# EAGLE design BusinessCard_LA_8CH (EAGLE 9.2.1)
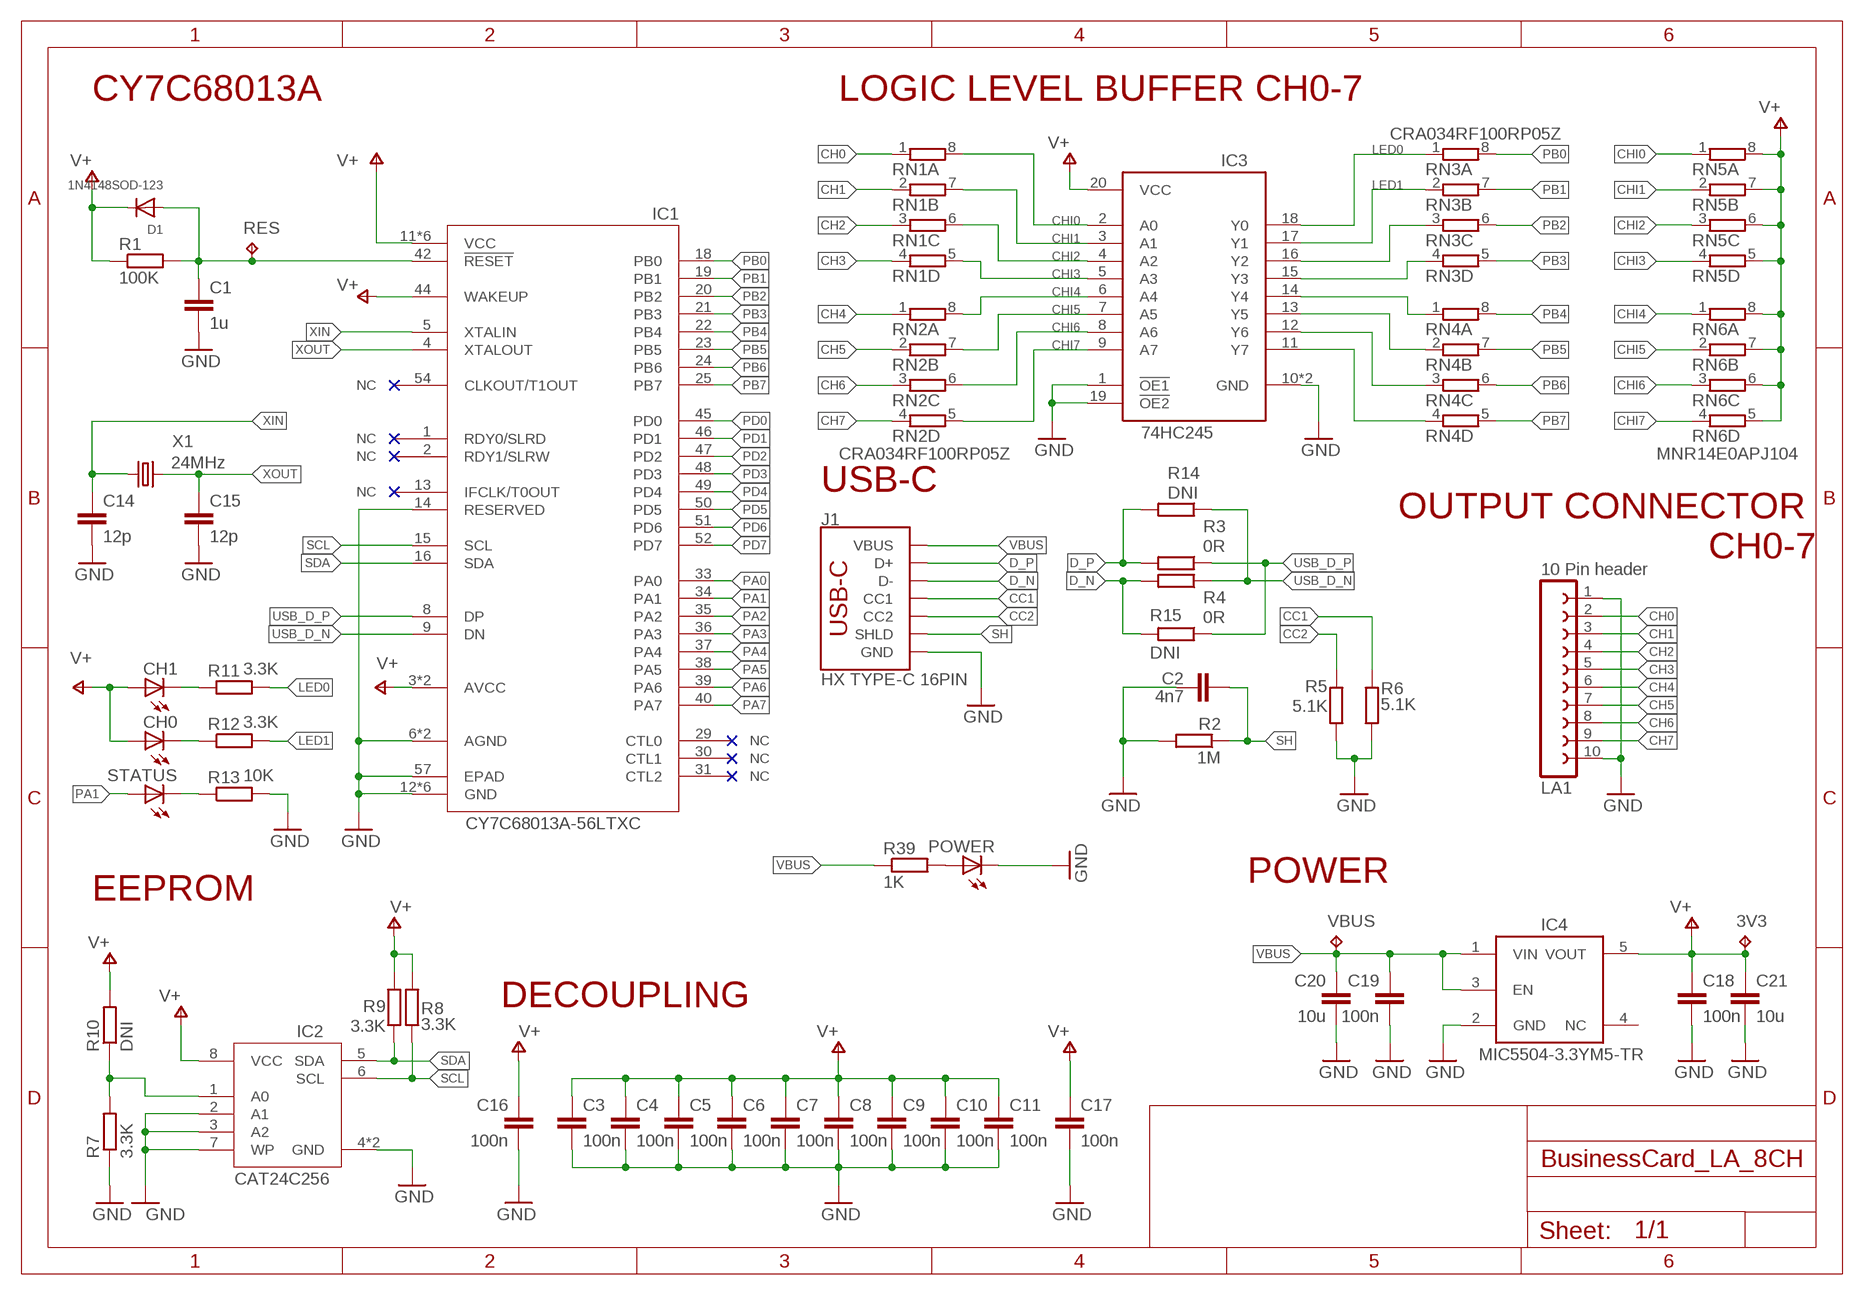
[diagram p0: schematic, sheet 1]

## Parts
3V3  TPB1,27  [B1,27]
C1  1u  C-EUC0402K  [C0402K]
C2  4n7  C-EUC0402K  [C0402K]
C3  100n  C-EUC0402K  [C0402K]
C4  100n  C-EUC0402K  [C0402K]
C5  100n  C-EUC0402K  [C0402K]
C6  100n  C-EUC0402K  [C0402K]
C7  100n  C-EUC0402K  [C0402K]
C8  100n  C-EUC0402K  [C0402K]
C9  100n  C-EUC0402K  [C0402K]
C10  100n  C-EUC0402K  [C0402K]
C11  100n  C-EUC0402K  [C0402K]
C14  12p  C-EUC0402K  [C0402K]
C15  12p  C-EUC0402K  [C0402K]
C16  100n  C-EUC0402K  [C0402K]
C17  100n  C-EUC0402K  [C0402K]
C18  100n  C-EUC0402K  [C0402K]
C19  100n  C-EUC0402K  [C0402K]
C20  10u  C-EUC0805K  [C0805K]
C21  10u  C-EUC0805K  [C0805K]
CH0  19-217/GHC-YR1S2/3T  LEDCHIP-LED0603  [CHIP-LED0603]
CH1  19-217/GHC-YR1S2/3T  LEDCHIP-LED0603  [CHIP-LED0603]
D1  1N4148SOD-123  DIODE_SOD-123FL  [SOD-123FL]
IC1  CY7C68013A-56LTXC  CY7C68013A-56QFNLFXC  [QFN50P800X800X100-57T665]
IC2  CAT24C256HU4IGT3  CAT24C256-HU4  [SON50P300X200X50-9T130X140N]
IC3  SN74LVC541ARGYR  74LVC541A  [QFN50P350X450X100-25T305X205N]
IC4  MIC5504-3.3YM5-TR  [SOT23-5]
J1  HX TYPE-C 16PIN  USB_C_2-LAYER_PADS  [USB-C-16P-2LAYER-PADS]
LA1  10 Pin header  FE10-1  [FE10]
POWER  19-213/Y2C-CQ2R2L/3T(CY)  LEDCHIP-LED0603  [CHIP-LED0603]
R1  100K  R-EU_R0402  [R0402]
R2  1M  R-EU_R0402  [R0402]
R3  0R  R-EU_R0402  [R0402]
R4  0R  R-EU_R0402  [R0402]
R5  5.1K  R-EU_R0402  [R0402]
R6  5.1K  R-EU_R0402  [R0402]
R7  3.3K  R-EU_R0402  [R0402]
R8  3.3K  R-EU_R0402  [R0402]
R9  3.3K  R-EU_R0402  [R0402]
R10  DNI  R-EU_R0402  [R0402]
R11  3.3K  R-EU_R0402  [R0402]
R12  3.3K  R-EU_R0402  [R0402]
R13  10K  R-EU_R0402  [R0402]
R14  DNI  R-EU_R0402  [R0402]
R15  DNI  R-EU_R0402  [R0402]
R39  1K  R-EU_R0402  [R0402]
RES  TPB1,27  [B1,27]
RN1  CRA034RF100RP05Z  4R-NCAT16  [CAT16]
RN2  CRA034RF100RP05Z  4R-NCAT16  [CAT16]
RN3  CRA034RF100RP05Z  4R-NCAT16  [CAT16]
RN4  CRA034RF100RP05Z  4R-NCAT16  [CAT16]
RN5  MNR14E0APJ104  4R-NCAT16  [CAT16]
RN6  MNR14E0APJ104  4R-NCAT16  [CAT16]
STATUS  YLED0603B  LEDCHIP-LED0603  [CHIP-LED0603]
VBUS  TPB1,27  [B1,27]
X1  24MHz  KX-7  [3.2X2.5_KX-7]

## Nets
CC1: J1.A5(CC1) R6.1
CC2: J1.B5(CC2) R5.1
CH0: LA1.2 RN1.1
CH1: LA1.3 RN1.2
CH2: LA1.4 RN1.3
CH3: LA1.5 RN1.4
CH4: LA1.6 RN2.1
CH5: LA1.7 RN2.2
CH6: LA1.8 RN2.3
CH7: LA1.9 RN2.4
CHI0: IC3.2(A0) RN1.8 RN5.1
CHI1: IC3.3(A1) RN1.7 RN5.2
CHI2: IC3.4(A2) RN1.6 RN5.3
CHI3: IC3.5(A3) RN1.5 RN5.4
CHI4: IC3.6(A4) RN2.8 RN6.1
CHI5: IC3.7(A5) RN2.7 RN6.2
CHI6: IC3.8(A6) RN2.6 RN6.3
CHI7: IC3.9(A7) RN2.5 RN6.4
D_N [DIFFPAIR]: J1.A7(D-) J1.B7(D-) R4.2 R15.2
D_P [DIFFPAIR]: J1.A6(D+) J1.B6(D+) R3.2 R14.2
GND: C1.2 C2.2 C3.2 C4.2 C5.2 C6.2 C7.2 C8.2 C9.2 C10.2 C11.2 C14.2 C15.2 C16.2 C17.2 C18.2 C19.2 C20.2 C21.2 IC1.6(AGND) IC1.10(AGND) IC1.12(GND) IC1.14(RESERVED) IC1.26(GND) IC1.28(GND) IC1.41(GND) IC1.53(GND) IC1.56(GND) IC1.57(EPAD) IC2.2(A1) IC2.3(A2) IC2.4(GND) IC2.7(WP) IC2.9(GND) IC3.1(!OE1) IC3.10(GND) IC3.19(!OE2) IC3.PAD(GND) IC4.2(GND) J1.GND J1.GND2(GND) LA1.1 LA1.10 POWER.C R2.2 R5.2 R6.2 R7.1 R13.2
LED0: IC3.18(Y0) R11.2 RN3.1
LED1: IC3.17(Y1) R12.2 RN3.2
N$1: IC2.1(A0) R7.2 R10.1
N$37: POWER.A R39.2
N$193: C1.1 D1.A IC1.42(!RESET) R1.2 RES.TP
N$194: IC3.16(Y2) RN3.3
N$195: IC3.15(Y3) RN3.4
N$198: IC3.14(Y4) RN4.1
N$199: IC3.13(Y5) RN4.2
N$200: IC3.12(Y6) RN4.3
N$201: IC3.11(Y7) RN4.4
N$205: CH1.C R11.1
N$206: CH0.C R12.1
N$207: R13.1 STATUS.C
PA0: IC1.33(PA0)
PA1: IC1.34(PA1) STATUS.A
PA2: IC1.35(PA2)
PA3: IC1.36(PA3)
PA4: IC1.37(PA4)
PA5: IC1.38(PA5)
PA6: IC1.39(PA6)
PA7: IC1.40(PA7)
PB0: IC1.18(PB0) RN3.8
PB1: IC1.19(PB1) RN3.7
PB2: IC1.20(PB2) RN3.6
PB3: IC1.21(PB3) RN3.5
PB4: IC1.22(PB4) RN4.8
PB5: IC1.23(PB5) RN4.7
PB6: IC1.24(PB6) RN4.6
PB7: IC1.25(PB7) RN4.5
PD0: IC1.45(PD0)
PD1: IC1.46(PD1)
PD2: IC1.47(PD2)
PD3: IC1.48(PD3)
PD4: IC1.49(PD4)
PD5: IC1.50(PD5)
PD6: IC1.51(PD6)
PD7: IC1.52(PD7)
SCL: IC1.15(SCL) IC2.6(SCL) R8.1
SDA: IC1.16(SDA) IC2.5(SDA) R9.1
SH: C2.1 J1.SHLD1(SHLD) J1.SHLD2(SHLD) J1.SHLD3(SHLD) J1.SHLD4(SHLD) R2.1
USB_D_N [DIFFPAIR]: IC1.9(DN) R4.1 R14.1
USB_D_P [DIFFPAIR]: IC1.8(DP) R3.1 R15.1
V+: 3V3.TP C3.1 C4.1 C5.1 C6.1 C7.1 C8.1 C9.1 C10.1 C11.1 C16.1 C17.1 C18.1 C21.1 CH0.A CH1.A D1.C IC1.3(AVCC) IC1.7(AVCC) IC1.11(VCC) IC1.17(VCC) IC1.27(VCC) IC1.32(VCC) IC1.43(VCC) IC1.44(WAKEUP) IC1.55(VCC) IC2.8(VCC) IC3.20(VCC) IC4.5(VOUT) R1.1 R8.2 R9.2 R10.2 RN5.5 RN5.6 RN5.7 RN5.8 RN6.5 RN6.6 RN6.7 RN6.8
VBUS: C19.1 C20.1 IC4.1(VIN) IC4.3(EN) J1.VBUS1(VBUS) J1.VBUS2(VBUS) R39.1 VBUS.TP
XIN: C14.1 IC1.5(XTALIN) X1.1
XOUT: C15.1 IC1.4(XTALOUT) X1.3
Unconnected: IC1.1(RDY0/SLRD) IC1.2(RDY1/SLRW) IC1.13(IFCLK/T0OUT) IC1.29(CTL0) IC1.30(CTL1) IC1.31(CTL2) IC1.54(CLKOUT/T1OUT) IC4.4(NC)

## Notes on the sheet
- CY7C68013A | LOGIC LEVEL BUFFER CH0-7
- USB-C
- OUTPUT CONNECTOR 
  CH0-7
- POWER
- EEPROM
- DECOUPLING

## Library data of the parts
3V3 RES VBUS = testpad:TP: Test pad
C1-C11 C14-C21 = rcl:C-EU: CAPACITOR, European symbol; SPICEPREFIX: C
CH0 CH1 POWER STATUS = led:LED: LED OSRAM: - CHIPLED LG R971, LG N971, LY N971, LG Q971, LY Q971, LO R971, LY R971 LH N974, LH R974 LS Q976, LO Q976, LY Q976 LO Q996 - Hyper CHIPLED LW Q18S LB Q993, LB Q99A, LB R99A - SideLED LS A670, LO A670, LY A670, LG A670, LP A670 LB A673, LV A673, LT A673, LW A673 LH A674 LY A675 LS A676, LA A676, LO A676, LY A676, LW A676 LS A679, LY A679, LG A679 - Hyper Micro SIDELED® LS Y876, LA Y876, LO Y876, LY Y876 LT Y87S - SmartLED LW L88C, LW L88S LB L89C, LB L89S, LG L890 LS L89K, LO L89K, LY L89K LS L896, LA L896, LO L896, LY L896 - TOPLED LS T670, LO T670, LY T670, LG T670, LP T670 LSG T670, LSP T670, LSY T670, LOP T670, LYG T670 LG T671, LOG T671, LSG T671 LB T673, LV T673, LT T673, LW T673 LH T674 LS T676, LA T676, LO T676, LY T676, LB T676, LH T676, LSB T676, LW T676 LB T67C, LV T67C, LT T67C, LS T67K, LO T67K, LY T67K, LW E67C LS E67B, LA E67B, LO E67B, LY E67B, LB E67C, LV E67C, LT E67C LW T67C LS T679, LY T679, LG T679 LS T770, LO T770, LY T770, LG T770, LP T770 LB T773, LV T773, LT T773, LW T773 LH T774 LS E675, LA E675, LY E675, LS T675 LS T776, LA T776, LO T776, LY T776, LB T776 LHGB T686 LT T68C, LB T68C - Hyper Mini TOPLED® LB M676 - Mini TOPLED Santana® LG M470 LS M47K, LO M47K, LY M47K Source: http://www.osram.convergy.de LUXEON: - LUMILED® LXK2-PW12-R00, LXK2-PW12-S00, LXK2-PW14-U00, LXK2-PW14-V00 LXK2-PM12-R00, LXK2-PM12-S00, LXK2-PM14-U00 LXK2-PE12-Q00, LXK2-PE12-R00, LXK2-PE12-S00, LXK2-PE14-T00, LXK2-PE14-U00 LXK2-PB12-K00, LXK2-PB12-L00, LXK2-PB12-M00, LXK2-PB14-N00, LXK2-PB14-P00, LXK2-PB14-Q00 LXK2-PR12-L00, LXK2-PR12-M00, LXK2-PR14-Q00, LXK2-PR14-R00 LXK2-PD12-Q00, LXK2-PD12-R00, LXK2-PD12-S00 LXK2-PH12-R00, LXK2-PH12-S00 LXK2-PL12-P00, LXK2-PL12-Q00, LXK2-PL12-R00 Source: www.luxeon.com KINGBRIGHT: KA-3528ASYC Source: www.kingbright.com
D1 = adafruit:DIODE: Diode SMADIODE - SMA Surface Mount Package 20V 1A Schottky Diode Digikey: 641-1014-6-ND DO-1N4148 - Through Hole Small Current Diode SOD-123 20V 1 A (.5mV Vf) Schottky Diode - Digikey: MBRX120TPMSCT-ND SOD-323 10V 570mA (.38mV Vf, 3ns) Schottky Diode - Digikey: ZLLS410CT-ND SOD-523 30V 30mA Schottky Diode (RB751S-40TE61) - Digikey: RB751S-40TE61CT-ND SOT23-R/W - SOT23 Package (R = Solder Paste/Reflow Ovens, W = Hand-Soldering) BAT54Film 40V 300mA - Digikey: 497-7162-1-ND
IC1 = ds_ic_mcu:CY7C68013A-56QFNLFXC: EZ-USB FX2LP USB Microcontroller High-Speed USB Peripheral Controller
IC2 = ds_ic_memory:CAT24C256: The CAT24C256 is a EEPROM Serial 256−Kb I2C, internally organized as 32,768 words of 8 bits each. It features a 64−byte page write buffer and supports the Standard (100 kHz), Fast (400 kHz) and Fast−Plus (1 MHz) I2C protocol. Write operations can be inhibited by taking the WP pin High (this protects the entire memory). External address pins make it possible to address up to eight CAT24C256 devices on the same bus. On−Chip ECC (Error Correction Code) makes the device suitable for high reliability applications.
IC3 = ds_ic_logic:74LVC541: SNx4LVC541A Octal Buffers/Drivers With 3-State Outputs
IC4 = MCU:MIC5504-3.3YM5-TR
J1 = SparkFun-Connectors:USB_C: USB Type C 16Pin Connector Super Speed pins not available on the 16-pin purely SMD connector so this part is best for USB 2.0 implementations. D1 and D2 are tied together enabling D+/- no matter which way the cable is plugged into the connector. The two channel configuration pins (CC1/2) are exposed. These are normally connected to ground via 5.1k resistors but can be reconfigured for high current/high power applications. **4-LAYER BOARD WARNING!!** If designing 4-layer board, make sure to select the variant _4-LAYER-ISOLATED. The linked footprint (USB-C-16-4LAYER-ISOLATED) includes some very necessary cutout polygons in the inner layers (2 and 15). This prevents the PTH mounting shield legs on the USB connector from electrically connecting any other polygons on the inner layers (usually VCC and GND).; PROD_ID: CONN-14122
LA1 = con-lsta:FE10-1: FEMALE HEADER; OC_FARNELL: unknown; OC_NEWARK: unknown
R1-R15 R39 = rcl:R-EU_: RESISTOR, European symbol; SPICEPREFIX: R
RN1-RN6 = resistor-net:4R-N: Array Chip Resistor Source: RS Component / Phycomp; OC_FARNELL: unknown; OC_NEWARK: unknown
X1 = crystal-geyer_V1_0:KX: Quartz Crystals (MHz) SMD: KX - Serie Model Size l/w/h [mm] Frequency Range Frequency Stability Temp. Range [°C] Load Capacitance AECQ 200 availabel Datasheet KX-4 KX-5 KX-6 KX-7 KX-9A KX-9B KX-12A KX-12B KX-13 KX-20 KX-K KX-KS 1.6/1.2/0.3 2.0/1.6/0.45 2.5/2.0/0.55 3.2/2.5/0.8 5.0/3.2/1.0 5.0/3.2/1.1 6.0/3.5/1.1 6.0/3.5/1.0 7.0/5.0 /1.3 11.6/5.5/1.6 12.3/4.5/4.2 12.3/4.5/3.2 24.0 ~ 80.0 MHz 16.0 ~ 80.0 MHz 12.0 ~ 80.0 MHz 8.0 ~ 60.0 MHz 7,68 ~ 300,0 MHz 8,0 ~ 50,0 MHz 8,0 ~ 150,0 MHz 8,0 ~ 50,0 MHz 6,0 ~ 160,0 MHz 3,579 ~ 25,0 MHz 3,579 ~ 70,0 MHz 3,579 ~ 70,0 MHz ±10 … ±50ppm ±10 … ±50ppm ±10 … ±50ppm ±10 … ±50ppm ±10 … ±50ppm ±10 … ±50ppm ±10 … ±50ppm ±10 … ±50ppm ±10 … ±50ppm ±50ppm ±10 … ±50ppm ±10 … ±50ppm (*) -40°C …+85°C (*) -40°C …+125°C (*) -40°C …+125°C (*) -40°C …+125°C (*) -40°C …+105°C (*) -40°C …+105°C (*) -40°C …+125°C (*) -40°C …+105°C (*) -40°C …+105°C (*) -40°C …+105°C (*) -40°C …+85°C (*) -40°C …+85°C 8, 8…16 8, 8…16 10, 8…16 12, 7…20 16, 10…20 16, 10…20 16, 10…20 16, 12…20 16, 12…20 16, 12…20 16, 12…30 16, 12…30 - yes yes yes - - - - - - - - KX-4.pdf <http://www.geyer-electronic.de/uploads/tx_userartikelfrequenz/GEYER-KX-4.pdf> KX-5.pdf <http://www.geyer-electronic.de/uploads/tx_userartikelfrequenz/GEYER-KX-5.pdf> KX-6.pdf <http://www.geyer-electronic.de/uploads/tx_userartikelfrequenz/GEYER-KX-6.pdf> KX-7.pdf <http://www.geyer-electronic.de/uploads/tx_userartikelfrequenz/GEYER-KX-7.pdf> KX-9A.pdf <http://www.geyer-electronic.de/uploads/tx_userartikelfrequenz/GEYER-KX-9A.pdf> KX-9B.pdf <http://www.geyer-electronic.de/uploads/tx_userartikelfrequenz/GEYER-KX-9B.pdf> KX-12A.pdf <http://www.geyer-electronic.de/uploads/tx_userartikelfrequenz/GEYER-KX-12A.pdf> KX-12B.pdf <http://www.geyer-electronic.de/uploads/tx_userartikelfrequenz/GEYER-KX-12B.pdf> KX-13.pdf <http://www.geyer-electronic.de/uploads/tx_userartikelfrequenz/GEYER-KX-13.pdf> KX-20.pdf <http://www.geyer-electronic.de/uploads/tx_userartikelfrequenz/GEYER-KX-20.pdf> KX-K.pdf <http://www.geyer-electronic.de/uploads/tx_userartikelfrequenz/GEYER-KX-K.pdf> KX-KS.pdf <http://www.geyer-electronic.de/uploads/tx_userartikelfrequenz/GEYER-KX-KS.pdf> <http://www.geyer-electronic.de/fileadmin/template/img/logo-geyer-electronic.png> Details see: http://www.geyer-electronic.de/Frequenz-Produkte.9.0.html Created 2016-06-07, Hans Locher 2016 (C) Geyer Quartz Technology KX4,KX5,KX6,KX7,KX9A,KX9B,KX12A,KX12B,KX13,KX20,KXK,KXKS;1612;2016;2520;3225;5032;6035;7050;11655;12345;1,6x1,2;2,0x1,6;2,5x2,0;3,2x2,5;5,0x3,2;6,0x3,5;7,0x5,0;11,6x5,5;12,3x4,5;12,3x4,5;1.6x1.2;2.0x1.6;2.5x2.0;3.2x2.5;5.0x3.2;6.0x3.5;7.0x5.0;11.6x5.5;12.3x4.5;12.3x4.5;

## Net classes
1 DIFFPAIR: width 0.2 mm, drill 0.2 mm, clearance 0.1 mm

## Board
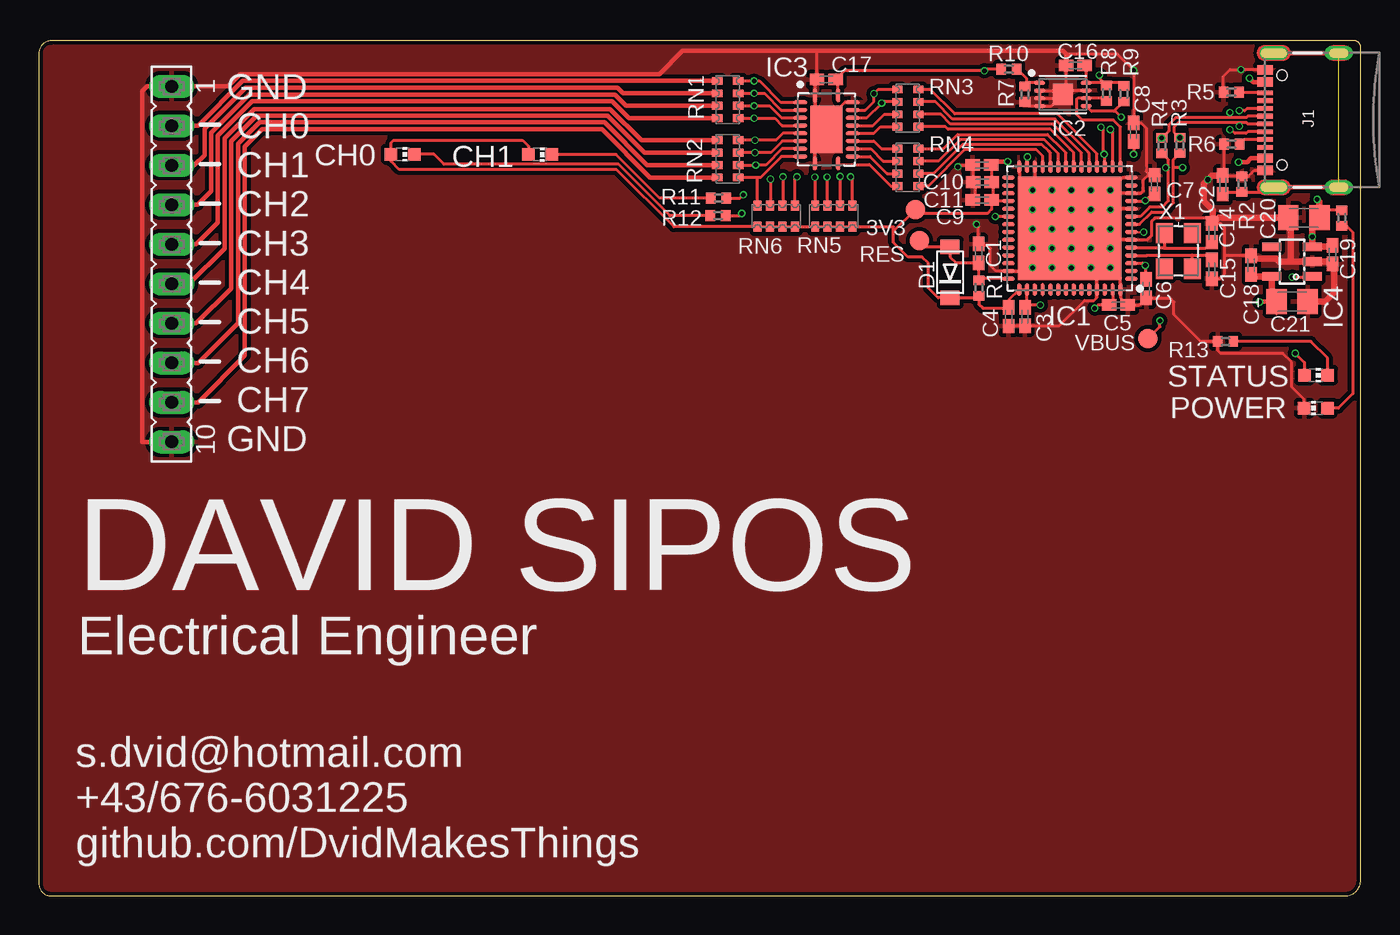
[diagram p1: board, top side]
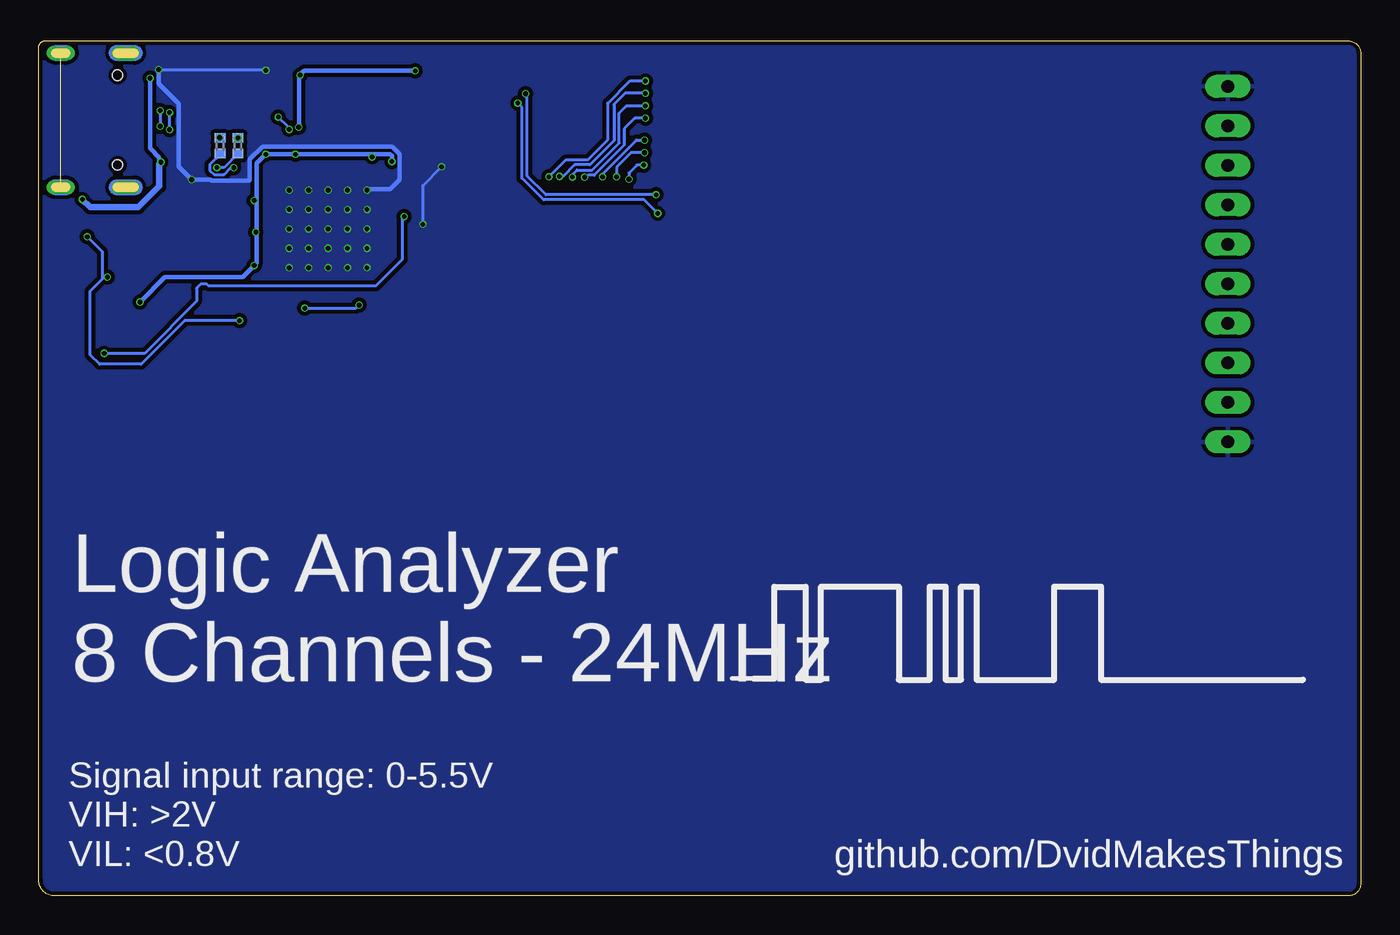
[diagram p2: board, bottom side, seen from below]

Size 85 x 55 mm. Coordinates in mm from the lower left corner, seen from the top.
Outline: 0,54.22 0,0.78 arc90 0.78,0 84,0 arc90 85,1 85,54.6 arc90 84.6,55 0.78,55 arc90 0,54.22
Copper layers (1*16): Top 0.035mm / dielectric 1.6mm / Bottom 0.035mm
Design rules "jlcpcb-2layers": minimum track width 5mil, minimum drill 0.3mm, track to track 5mil, track to pad 5mil, pad to pad 5mil, via to via 5mil, smd to smd 5mil, copper to edge 0.2mm, drill to drill 6mil, minimum pad ring 10mil, minimum via ring 3mil, stop-mask expansion 4mil, vias tented up to drill 0mil, thermal gap 10mil

### Footprints (pad centres in the part's own frame; a part is rotated, then mirrored left to right if it is on the bottom)
B1,27 = smd 1.27 x 1.27: TP 0,0
C0402K = smd 0.925 x 0.74: 1 -0.6,0; 2 0.6,0
C0805K = smd 1.3 x 1.6: 1 -1,0; 2 1,0
CHIP-LED0603 = smd 0.8 x 0.8: A 0,-0.75; C 0,0.75
SOD-123FL = smd 0.91 x 1.22: A 1.637,0; C -1.637,0
QFN50P800X800X100-57T665 = smd 0.811 x 0.264: 1 -3.951,3.25; 2 -3.951,2.75; 3 -3.951,2.25; 4 -3.951,1.75; 5 -3.951,1.25; 6 -3.951,0.75; 7 -3.951,0.25; 8 -3.951,-0.25; 9 -3.951,-0.75; 10 -3.951,-1.25; 11 -3.951,-1.75; 12 -3.951,-2.25; 13 -3.951,-2.75; 14 -3.951,-3.25; 29 3.951,-3.25; 30 3.951,-2.75; 31 3.951,-2.25; 32 3.951,-1.75; 33 3.951,-1.25; 34 3.951,-0.75; 35 3.951,-0.25; 36 3.951,0.25; 37 3.951,0.75; 38 3.951,1.25; 39 3.951,1.75; 40 3.951,2.25; 41 3.951,2.75; 42 3.951,3.25 | smd 0.264 x 0.811: 15 -3.25,-3.951; 16 -2.75,-3.951; 17 -2.25,-3.951; 18 -1.75,-3.951; 19 -1.25,-3.951; 20 -0.75,-3.951; 21 -0.25,-3.951; 22 0.25,-3.951; 23 0.75,-3.951; 24 1.25,-3.951; 25 1.75,-3.951; 26 2.25,-3.951; 27 2.75,-3.951; 28 3.25,-3.951; 43 3.25,3.951; 44 2.75,3.951; 45 2.25,3.951; 46 1.75,3.951; 47 1.25,3.951; 48 0.75,3.951; 49 0.25,3.951; 50 -0.25,3.951; 51 -0.75,3.951; 52 -1.25,3.951; 53 -1.75,3.951; 54 -2.25,3.951; 55 -2.75,3.951; 56 -3.25,3.951 | smd 6.65 x 6.65: 57 0,0
SON50P300X200X50-9T130X140N = smd 0.711 x 0.27: 1 -1.501,0.75; 2 -1.501,0.25; 3 -1.501,-0.25; 4 -1.501,-0.75; 5 1.501,-0.75; 6 1.501,-0.25; 7 1.501,0.25; 8 1.501,0.75 | smd 1.3 x 1.4: 9 0,0
QFN50P350X450X100-25T305X205N = smd 0.264 x 0.896: 1 -0.75,2.187; 10 -0.75,-2.187; 11 0.75,-2.187; 20 0.75,2.187 | smd 0.896 x 0.264: 2 -1.687,1.75; 3 -1.687,1.25; 4 -1.687,0.75; 5 -1.687,0.25; 6 -1.687,-0.25; 7 -1.687,-0.75; 8 -1.687,-1.25; 9 -1.687,-1.75; 12 1.687,-1.75; 13 1.687,-1.25; 14 1.687,-0.75; 15 1.687,-0.25; 16 1.687,0.25; 17 1.687,0.75; 18 1.687,1.25; 19 1.687,1.75 | smd 2.05 x 3.05: PAD 0,0
SOT23-5 = smd 0.55 x 1.2: 1 -0.95,-1.3; 2 0,-1.3; 3 0.95,-1.3; 4 0.95,1.3; 5 -0.95,1.3
USB-C-16P-2LAYER-PADS = smd 0.3 x 1: A5 -1.25,-0.34; A6 -0.25,-0.34; A7 0.25,-0.34; A8 1.25,-0.34; B5 1.75,-0.34; B6 0.75,-0.34; B7 -0.75,-0.34; B8 -1.75,-0.34 | smd 0.6 x 1: GND -3.225,-0.34; GND2 3.225,-0.34; VBUS1 -2.45,-0.34; VBUS2 2.45,-0.34 | drill 0.4 pad 0.6 long: SHLD1 -4.318,-0.915; SHLD2 4.318,-0.915; SHLD3 -4.318,-5.095; SHLD4 4.318,-5.095 | hole 0.65: -2.89,-1.445; 2.89,-1.445
FE10 = drill 0.813 long: 1 -11.43,0; 2 -8.89,0; 3 -6.35,0; 4 -3.81,0; 5 -1.27,0; 6 1.27,0; 7 3.81,0; 8 6.35,0; 9 8.89,0; 10 11.43,0
R0402 = smd 0.6 x 0.7: 1 -0.5,0; 2 0.5,0
CAT16 = smd 0.5 x 0.65: 1 -1.2,-0.675; 2 -0.4,-0.675; 3 0.4,-0.675; 4 1.2,-0.675; 5 1.2,0.675; 6 0.4,0.675; 7 -0.4,0.675; 8 -1.2,0.675
3.2X2.5_KX-7 = smd 1.3 x 1.1: 1 -1.15,-0.9; 2 1.15,-0.9; 3 1.15,0.9; 4 -1.15,0.9

### Placement (x,y rotation side)
3V3  56.36,44.14 0 top
C1  60.43,41.33 90 top
C2  76.13,45.74 90 top
C3  63.41,37.27 270 top
C4  62.36,37.25 270 top
C5  69.42,38.01 0 top
C6  71.21,39.06 270 top
C7  71.74,45.76 90 top
C8  70.39,49.13 90 top
C9  60.66,44.76 180 top
C10  60.64,47.01 180 top
C11  60.67,45.91 180 top
C14  75.43,42.65 90 top
C15  75.43,40.3 270 top
C16  66.66,53.41 180 top
C17  50.64,52.51 180 top
C18  77.96,40.58 90 top
C19  83.19,41.25 270 top
C20  81.35,43.62 180 top
C21  80.59,38.23 0 top
CH0  23.39,47.7 270 top
CH1  32.23,47.68 270 top
D1  58.6,40.11 90 top
IC1  66.3,42.95 180 top
IC2  65.85,51.55 0 top
IC3  50.65,49.3 0 top
IC4  80.59,40.8 90 top
J1  78.5,49.9 90 top
LA1  8.54,40.64 270 top
POWER  82.12,31.38 90 top
R1  60.45,39.1 90 top
R2  77.37,45.78 90 top
R3  73.37,48.27 90 top
R4  72.22,48.26 90 top
R5  76.68,51.7 180 top
R6  76.71,48.35 180 top
R7  63.4,51.56 90 top
R8  68.65,51.63 90 top
R9  69.77,51.59 90 top
R10  62.38,53.17 180 top
R11  43.71,44.89 0 top
R12  43.68,43.75 0 top
R13  76.31,35.67 180 top
R14  73.35,48.25 90 bottom
R15  72.2,48.25 90 bottom
R39  83.78,43.6 270 top
RES  56.64,42.14 0 top
RN1  44.3,51.22 270 top
RN2  44.3,47.41 270 top
RN3  55.88,50.67 270 top
RN4  55.88,46.86 270 top
RN5  51.12,43.72 180 top
RN6  47.42,43.72 180 top
STATUS  82.13,33.49 270 top
VBUS  71.32,35.84 0 top
X1  73.27,41.49 270 top

### Tracks (layer width: path | path; a pad name or v marks a point on that pad's centre or on a via)
CC1
  Top 0.203: J1.A5 77.51,48.65 R6.1
CC2
  Top 0.203: J1.B5 77.23,51.65 R5.1
CH0
  Top 0.305: RN1.1 13.12,52.42 10.23,49.53 LA1.2
CH1
  Top 0.305: RN1.2 37.57,51.62 37.2,51.99 13.3,51.99 10.65,49.34 10.65,47.65 9.99,46.99 LA1.3
CH2
  Top 0.305: RN1.3 37.76,50.82 37.04,51.54 13.61,51.54 13.59,51.56 13.55,51.56 11.08,49.09 11.08,45.33 10.2,44.45 LA1.4
CH3
  Top 0.305: RN1.4 37.95,50.02 36.86,51.11 13.71,51.11 11.51,48.91 11.51,43.31 10.11,41.91 LA1.5
CH4
  Top 0.305: RN2.1 38.75,48.61 36.74,50.62 13.83,50.62 11.95,48.73 11.95,41.65 9.67,39.37 LA1.6
CH5
  Top 0.305: RN2.2 38.94,47.81 36.56,50.19 14.01,50.19 12.38,48.55 12.38,39.08 10.13,36.83 LA1.7
CH6
  Top 0.305: RN2.3 39.12,47.01 36.38,49.75 14.19,49.75 12.81,48.37 12.81,36.86 10.24,34.29 LA1.8
CH7
  Top 0.305: RN2.4 39.31,46.21 36.2,49.32 14.37,49.32 13.24,48.19 13.24,34.74 10.25,31.75 LA1.9
CHI0  (via drill 0.3)
  Top 0.203: RN5.1 52.32,46.13 v52.2,46.25 | RN1.8 v46,52.42 46.33,52.42 47.7,51.05 IC3.2
  Bottom 0.203: v52.2,46.25 51.1,47.35 49.7,47.35 48.4,48.65 48.4,51 46.98,52.42 v46,52.42
CHI1  (via drill 0.3)
  Top 0.203: RN1.7 v46,51.62 46.66,51.62 47.73,50.55 IC3.3 | v51.53,46.28 51.53,44.4 RN5.2
  Bottom 0.203: v46,51.62 47.31,51.62 48.02,50.92 48.02,48.57 49.56,47.02 50.55,47.02 51.29,46.28 v51.53,46.28
CHI2  (via drill 0.3)
  Top 0.203: RN1.6 v46,50.82 47,50.82 47.77,50.05 IC3.4 | RN5.3 50.72,46.21 v50.69,46.24
  Bottom 0.203: v50.69,46.24 50.69,46.4 50.4,46.69 49.43,46.69 47.69,48.43 47.69,50.35 47.22,50.82 v46,50.82
CHI3  (via drill 0.3)
  Top 0.203: RN1.5 v46,50.02 47.33,50.02 47.8,49.55 IC3.5 | v49.9,46.23 49.92,46.22 RN5.4
  Bottom 0.203: v46,50.02 46.68,50.02 47.36,49.34 47.36,48.29 49.29,46.36 49.7,46.36 49.83,46.23 v49.9,46.23
CHI4  (via drill 0.3)
  Top 0.203: IC3.6 47.85,49.05 47.41,48.61 v46.05,48.61 RN2.8 | RN6.1 48.62,46.12 v48.75,46.25
  Bottom 0.203: v48.75,46.25 48.75,46.43 46.57,48.61 v46.05,48.61
CHI5  (via drill 0.3)
  Top 0.203: IC3.7 47.82,48.55 47.08,47.81 v46.05,47.81 RN2.7 | v47.85,46.25 47.85,44.42 RN6.2
  Bottom 0.203: v46.05,47.81 46.91,47.81 47.85,46.87 v47.85,46.25
CHI6  (via drill 0.3)
  Top 0.203: IC3.8 47.78,48.05 46.74,47.01 v46.1,47.01 RN2.6 | v47.05,46.1 47.05,44.42 RN6.3
  Bottom 0.203: v46.1,47.01 46.54,47.01 47.05,46.5 v47.05,46.1
CHI7
  Top 0.203: IC3.9 47.75,47.55 46.41,46.21 46.15,46.21 | 46.15,46.21 RN2.5 | RN6.4 46.22,46.14 46.15,46.21
D_N  (via drill 0.3)
  Top 0.2: J1.A7 77.74,50.15 77.65,50.06 76.6,50.06 | 76.6,50.06 73.11,50.06 72.65,49.6 72.65,49.19 R4.2 R15.2 | v76.6,49.28 76.69,49.28 76.91,49.06 77.65,49.06 77.74,49.15 J1.B7 | v76.6,50.39 76.6,50.06
  Bottom 0.2: v76.6,49.28 v76.6,50.39
  other vias: 72.2,48.75
D_P  (via drill 0.3)
  Top 0.2: J1.A6 77.74,49.65 77.65,49.74 77.2,49.74 | 77.2,49.74 73.29,49.74 73,49.45 73,49.14 R3.2 | J1.B6 77.69,50.65 77.54,50.5 77.22,50.5 v77.2,50.52 | v77.2,49.51 77.2,49.74
  Bottom 0.2: R3.2 R14.2 | v77.2,50.52 v77.2,49.51
  other vias: 73.37,48.77
GND  (via drill 0.3)
  Top 0.127: 69.2,44.2 68.95,44.2 v68.9,44.15
  Top 0.2: IC2.3 IC2.2 65.6,51.8 IC2.9 | IC2.3 IC2.4 | IC2.4 63.66,50.8 R7.1 | IC2.3 65.6,51.3 IC2.9 | IC2.4 65.1,50.8 IC2.9 | IC2.7 66.1,51.8 IC2.9 | C16.2 66.06,51.76 IC2.9 | 66.19,54.14 66.12,54.08 66.08,54.02 | C6.2 71.17,38.42 70.76,38.01 C5.2 69.55,38.48 IC1.56 69.55,39.75 v68.9,40.4 68.85,40.4 IC1.57 | C4.2 62.38,36.67 C3.2 65.62,36.67 67.25,38.3 67.85,38.3 68.05,38.5 IC1.53 68.05,40 v67.65,40.4 v66.4,41.65 66.3,41.75 IC1.57 | C7.2 71.34,46.36 71.04,46.06 71.04,45.36 70.88,45.2 IC1.12 69.1,45.2 v68.9,45.4 | v70.4,53.1 C8.2 | C10.2 60.07,46.98 C11.2 | 60.19,45.95 60.19,44.89 C9.2 | C1.2 60.51,41.85 61,41.85 61.2,41.65 61.2,40.55 61.55,40.2 IC1.41 63.7,40.2 63.83,40.33 | 78,46.51 78.17,46.67 J1.GND | v77.3,53.15 78.81,53.15 J1.GND2 | IC1.10 69.2,44.2 | 63.83,40.33 v63.9,40.4 | 71.33,42.23 71.3,42.2 IC1.6 69.45,42.2 69.42,42.17 67.08,42.17 IC1.57 | IC1.26 64.05,45.55 | 64.05,45.55 v63.9,45.4 63.05,46.25 IC1.28 | 66.3,44.05 66.3,44.25 | 66.3,44.25 v65.15,45.4 v65.15,44.15 65.15,44.1 IC1.57 | 66.3,44.25 66.3,45.3 v66.4,45.4 | 66.3,44.05 v67.65,45.4 | v68.9,45.4 68.75,45.4 IC1.57 | IC1.57 65.1,44.15 v63.9,44.15 | IC1.57 66.3,44.05 | v68.9,44.15 68.8,44.15 67.6,42.95 | IC1.57 67.6,42.95 | 67.6,42.95 v67.65,42.9 | IC1.57 63.95,42.95 v63.9,42.9 | IC1.57 65.2,42.95 v65.15,42.9 v63.9,41.65 | IC1.57 63.83,40.48 63.83,40.33 | v65.15,40.4 v65.15,41.65 65.15,41.8 IC1.57 | IC1.57 66.3,40.5 v66.4,40.4 | IC1.57 64.05,45.2 64.05,45.55 | IC1.57 66.35,42.9 v68.9,42.9 | IC1.57 67.6,41.65 v68.9,41.65 | IC1.57 66.45,42.95 v67.65,44.15 | IC1.14 69.7,46.2 v68.9,45.4
  Top 0.203: 71.33,42.23 71.55,42.45 71.55,43.4 71.75,43.6 75.08,43.6 C14.2 75.5,43.25 76,43.25 76.25,43 76.25,41.2 | C15.2 75.95,39.7 76.25,40 76.25,41.2 | IC3.PAD 49.9,50.05 IC3.1 49.9,52.37 C17.2 50.04,54.29 50.1,54.35 | IC3.19 51.85,51.05 50.65,49.85 IC3.PAD | IC3.10 49.9,48.55 IC3.PAD | 78,46.51 77.78,46.28 R2.2 77.31,46.34 C2.2 76.21,46.42 R6.2 | 71.17,38.42 72.78,38.42 73,38.2 73,37.4 74.73,35.67 R13.2 75.81,35.09 76,34.9 80,34.9 80.57,34.33 80.57,32.74 81.37,31.94 POWER.C | C8.2 70.87,49.73 71.21,49.39 71.21,46.59 71.44,46.36 C7.2 | C1.2 60.43,43.07 v60.3,43.2 | v59.1,46.9 59.21,47.01 C10.2 | C18.2 77.94,41.2 76.25,41.2 | R5.2 76.18,52.73 76.6,53.15 v77.3,53.15 | v70.4,53.1 69.36,54.14 66.19,54.14
  Top 0.305: 66.12,54.08 65.85,54.35 50.1,54.35 41.4,54.35 39.9,52.85 12.94,52.85 12.16,52.07 LA1.1 6.97,52.07 6.65,51.75 6.65,29.2 6.66,29.21 LA1.10 | 66.08,54.02 66.08,53.42 C16.2 | C11.2 60.15,45.91 60.19,45.95
  Top 0.406: C21.2 82.73,38.23 83.3,38.8 83.3,40.54 C19.2 83.04,40.8 IC4.2 80.5,40.8 | C18.2 78.14,41 79.55,41 79.75,40.8 80.5,40.8 | 80.5,40.8 80.5,43.47 C20.2 75.87,43.62 75.5,43.25 75.5,44.1 74.9,44.7 74.9,45.8 v75.17,46.08 75.44,46.34 C2.2
  Bottom 0.203: v60.3,43.2 60.3,45.7 v59.1,46.9 | v77.3,53.15 70.45,53.15 v70.4,53.1
  Bottom 0.305: v77.3,53.15 77.3,52.25 76,50.95 76,46.9 v75.17,46.08 73.95,46.08 73.89,46.02 71.49,46.02 71.43,46.08 71.43,47.38 70.61,48.21 62.3,48.21 61.79,47.7 61.79,46.06 62.4,45.45 63.85,45.45 v63.9,45.4
  other vias: 66.4,42.9 67.65,41.65 66.4,44.15
  pour Top (isolate 0.254): -2.76,56.5 87.55,56.5 87.55,-1.9 -2.76,-1.9
  pour Bottom (isolate 0.254): -3.98,56.5 88,56.5 88,-1.9 -3.98,-1.9
LED0  (via drill 0.3)
  Top 0.2: R11.2 45.09,44.89 v45.3,45.1 | RN3.1 53.97,51.87 v53.7,51.6 53.7,51.1 53.15,50.55 IC3.18
  Bottom 0.2: v45.3,45.1 52.4,45.1 53.6,46.3 53.6,51.6 v53.7,51.6
LED1  (via drill 0.3)
  Top 0.2: R12.2 45.05,43.76 v45.2,43.9 | IC3.17 53.25,50.05 v54.2,51 54.27,51.07 RN3.2
  Bottom 0.2: v45.2,43.9 46.07,44.77 52.53,44.77 53.93,46.16 53.93,50.73 v54.2,51
N$1
  Top 0.2: IC2.1 63.64,52.3 R7.2
  Top 0.203: R10.1 62.93,53.17 63.5,52.6 63.5,52.16 R7.2
N$37
  Top 0.203: R39.2 84.08,43.1 84.5,42.68 84.5,32.31 83.56,31.38 POWER.A
N$193
  Top 0.2: D1.A 58.6,41.1 58.97,40.73 C1.1 60.43,39.8 | 60.43,39.8 60.43,39.62 R1.2 | IC1.42 60.53,39.7 60.43,39.8
  Top 0.203: RES.TP 57.03,41.75 D1.A
N$194
  Top 0.203: IC3.16 53.65,49.55 54.37,50.27 RN3.3
N$195
  Top 0.203: IC3.15 53.7,49.05 54.12,49.47 RN3.4
N$198
  Top 0.203: IC3.14 53.7,48.55 54.19,48.06 RN4.1
N$199
  Top 0.203: IC3.13 53.5,48.05 54.29,47.26 RN4.2
N$200
  Top 0.203: IC3.12 53.45,47.55 54.54,46.46 RN4.3
N$201
  Top 0.203: IC3.11 51.46,47.05 53.4,47.05 54.79,45.66 RN4.4
N$205
  Top 0.2: R11.1 39.91,44.89 37.12,47.68 CH1.C
N$206
  Top 0.2: R12.1 40.58,43.76 37.28,47.05 26.05,47.05 25.4,47.7 CH0.C
N$207
  Top 0.2: STATUS.C 82.88,34.59 81.81,35.67 R13.1
PA1  (via drill 0.3)
  Top 0.2: IC1.34 61.56,43.7 61.53,43.73
  Top 0.203: 61.53,43.73 v61.51,43.7 | v80.8,34.9 81.38,34.32 STATUS.A
  Bottom 0.203: v61.51,43.7 61.63,43.58 61.63,40.94 63.34,39.23 74.09,39.23 74.21,39.35 74.59,39.35 74.86,39.09 74.86,38.24 78.2,34.9 v80.8,34.9
PB0
  Top 0.2: IC1.18 68.05,47.73 67.89,47.89
  Top 0.203: 67.89,47.89 65.48,50.3 58.9,50.3 57.33,51.87 RN3.8
PB1
  Top 0.2: IC1.19 67.55,47.77 67.48,47.83
  Top 0.203: 67.48,47.83 65.35,49.97 58.76,49.97 57.66,51.07 RN3.7
PB2
  Top 0.2: IC1.20 67.05,47.8 67,47.85
  Top 0.203: RN3.6 58,50.27 58.63,49.64 65.21,49.64 67,47.85
PB3
  Top 0.2: IC1.21 66.55,47.81 66.33,48.03
  Top 0.203: 66.33,48.03 65.05,49.31 58.47,49.31 58.3,49.47 RN3.5
PB4
  Top 0.2: IC1.22 66.05,47.8 65.88,47.98
  Top 0.203: 65.88,47.98 64.87,48.98 59.08,48.98 58.16,48.06 RN4.8
PB5
  Top 0.2: IC1.23 65.55,47.75 65.3,48
  Top 0.203: 65.3,48 64.65,48.65 59.25,48.65 57.86,47.26 RN4.7
PB6
  Top 0.2: IC1.24 65.05,47.78 64.94,47.89
  Top 0.203: 64.94,47.89 64.51,48.32 59.39,48.32 57.53,46.46 RN4.6
PB7
  Top 0.2: IC1.25 64.55,47.59 64.15,47.99
  Top 0.203: 64.15,47.99 59.52,47.99 57.19,45.66 RN4.5
SCL
  Top 0.2: R8.1 68.48,51.3 IC2.6 66.8,51.3 66.75,51.25 66.75,50.25 67.1,49.9 69.1,49.9 69.55,49.45 IC1.15
SDA  (via drill 0.3)
  Top 0.2: 69.14,50.46 67.69,50.46 IC2.5 | 69.14,50.46 R9.1 | v69.6,50.1 69.24,50.46 69.14,50.46 | IC1.16 69.05,49.15 v68.9,49.3
  Bottom 0.2: v68.9,49.3 68.9,49.4 v69.6,50.1
SH  (1 unrouted)
  Top 0.2: 78.4,45.28 78.7,45.58 J1.SHLD1
  Top 0.203: C2.1 76.27,45.28 R2.1 78.4,45.28 79.12,45.28
  Top 0.305: J1.SHLD2 J1.SHLD4 | J1.SHLD1 J1.SHLD3
USB_D_N  (via drill 0.3)
  Top 0.2: 72.64,46.85 72.64,44.72 72.23,44.31 71.43,44.31 70.82,43.7 IC1.9 | 72.64,46.85 72.64,47.34 R4.1 | v72.46,46.85 72.63,46.85 72.64,46.85
  Bottom 0.2: v72.46,46.85 72.46,46.86 72.62,46.86 73.09,46.4 73.74,46.4 74,46.66 74,47.04 73.35,47.69 R14.1
USB_D_P  (via drill 0.3)
  Top 0.2: 72.96,46.85 72.96,44.58 72.37,43.99 71.57,43.99 70.78,43.2 IC1.8 | 72.96,46.85 72.96,47.36 R3.1 | v73.55,46.85 72.96,46.85
  Bottom 0.2: R15.1 73.1,46.85 v73.55,46.85
V+  (via drill 0.3)
  Top 0.127: IC1.7 70.89,42.7 70.97,42.78
  Top 0.2: IC2.8 68.48,52.3 R8.2 68.2,52.58 v68.2,52.8 | IC2.8 67.35,53.32 C16.1 | R9.2 69.56,52.3 IC2.8 | v68.3,49.45 68.45,49.3 68.45,47.76 v68.5,47.7 68.55,47.65 IC1.17 | 69.12,38.31 C5.1 69.05,38.24 IC1.55 | v71.15,40.55 71.15,39.72 C6.1 | 63.62,38.08 63.52,37.98 C3.1 63.55,38.01 IC1.44 IC1.43 | C4.1 62.36,38.31 IC1.43 | 63.12,39.07 IC1.43 | C8.1 v70.4,47.7 | v71.16,44.73 71.42,44.98 | C7.1 71.56,44.98 71.42,44.98 | 61.59,47.11 61.59,47.21 | 61.49,47.11 61.39,47.01 C10.1 61.24,46.1 61.35,45.99 61.39,45.95 61.39,44.89 61.3,44.8 | 61.28,44.78 C9.1 61.3,44.8 | D1.C 60.32,38.47 R1.1 | CH1.A 31.48,48.22 31.1,48.6 22.8,48.6 22.64,48.44 CH0.A 22.64,47.26 23.17,46.73 37.15,46.73 40.83,43.05 RN6.5 | 71.42,44.98 arc-90 71.13,44.7 IC1.11 | IC1.27 63.55,47.52 v63.56,47.53 | IC1.32 61.4,44.7 61.3,44.8 | IC1.3 70.94,40.7 70.97,40.73
  Top 0.203: 70.97,42.78 v71.05,42.7 | 70.97,40.73 v71.15,40.55 | IC3.20 51.4,52.35 C17.1 51.8,53.07 v60.8,53.07 60.9,53.17 R10.2 | RN6.5 RN6.6 RN6.7 RN6.8 RN5.5 RN5.6 RN5.7 RN5.8 54.97,43.05 54.97,42.74 | 79.59,37.44 C21.1 | 54.97,42.74 3V3.TP 56.6,43.9 61,43.9 61.26,44.16 C9.1 | R1.1 60.45,38.05 60.7,37.8 62.31,37.8 C4.1 | D1.C 57.83,38.47 57.2,39.1 57.2,40.7 56.8,41.1 55.9,41.1 54.97,42.03 54.97,42.74 | C5.1 68.11,38.01 v67.9,37.8 | v64.4,38 63.54,38 63.52,37.98
  Top 0.305: C11.1 61.35,45.99 | C21.1 78.53,38.23 v78.5,38.2 | v62.3,47.23 61.61,47.23 61.59,47.21 61.49,47.11
  Top 0.406: C21.1 79.29,38.53 IC4.5 78.09,39.85 C18.1
  Bottom 0.2: 68.27,49.47 v68.3,49.45 | v63.56,47.53 63.56,47.69 63.55,47.7 | 70.95,45.05 71.16,44.84 v71.16,44.73
  Bottom 0.203: 70.95,42.8 70.95,45.05 70.95,47.15 | v67.9,37.8 64.6,37.8 v64.4,38
  Bottom 0.305: v60.8,53.07 67.93,53.07 v68.2,52.8 68.27,52.73 68.27,49.47 | v78.5,38.2 76.9,39.8 71.9,39.8 v71.15,40.55 71,40.7 71,42.75 | 71,42.75 71,47.1 70.95,47.15 v70.4,47.7 v68.5,47.7 63.55,47.7 62.4,47.7 62.3,47.6 v62.3,47.23 | v71.05,42.7 71,42.75
VBUS  (via drill 0.3)
  Top 0.203: R39.1 82.83,44.1 C20.1 | VBUS.TP 72.1,36.62 v72.1,37 | v80.6,39.8 81.84,39.8 IC4.1
  Top 0.305: v77.15,47.2 77.7,47.2 77.95,47.45 J1.VBUS1 | J1.VBUS2 78.1,52.35 v77.85,52.6
  Top 0.406: C19.1 83.09,41.75 IC4.3 v81.89,42.4 81.89,43.16 C20.1 82.35,44.65 v82.2,44.8
  Bottom 0.203: v72.1,37 75.63,37 78.43,34.2 81.1,34.2 81.7,34.8 81.7,38.9 80.9,39.7 | v80.6,39.8 80.8,39.8 80.9,39.7 | 80.9,39.7 80.9,41.41 v81.89,42.4
  Bottom 0.305: v77.85,52.6 77.85,48.1 77.25,47.5 77.25,47.1
  Bottom 0.406: v82.2,44.8 81.7,44.3 78.6,44.3 77.25,45.65 77.25,47.1 v77.15,47.2
XIN
  Top 0.2: IC1.5 72.32,41.7 72.35,41.73
  Top 0.203: C14.1 75.06,41.68 72.3,41.68 72.35,41.73 72.37,41.75 X1.1
XOUT
  Top 0.2: IC1.4 71.25,41.2 71.27,41.22 74.16,41.22
  Top 0.203: C15.1 75.1,41.23 74.15,41.23 74.16,41.22 74.17,41.21 X1.3

### Text on the board
tNames: GND / CH0 / CH1 / CH2 / CH3 / CH4 / CH5 / CH6 / CH7 / GND | DAVID SIPOS | Electrical Engineer | s.dvid@hotmail.com / +43/676-6031225 / github.com/DvidMakesThings
bNames: Logic Analyzer / 8 Channels - 24MHz | github.com/DvidMakesThings | Signal input range: 0-5.5V / VIH: >2V / VIL: <0.8V